# EAGLE design v1 (EAGLE 9.0.1)
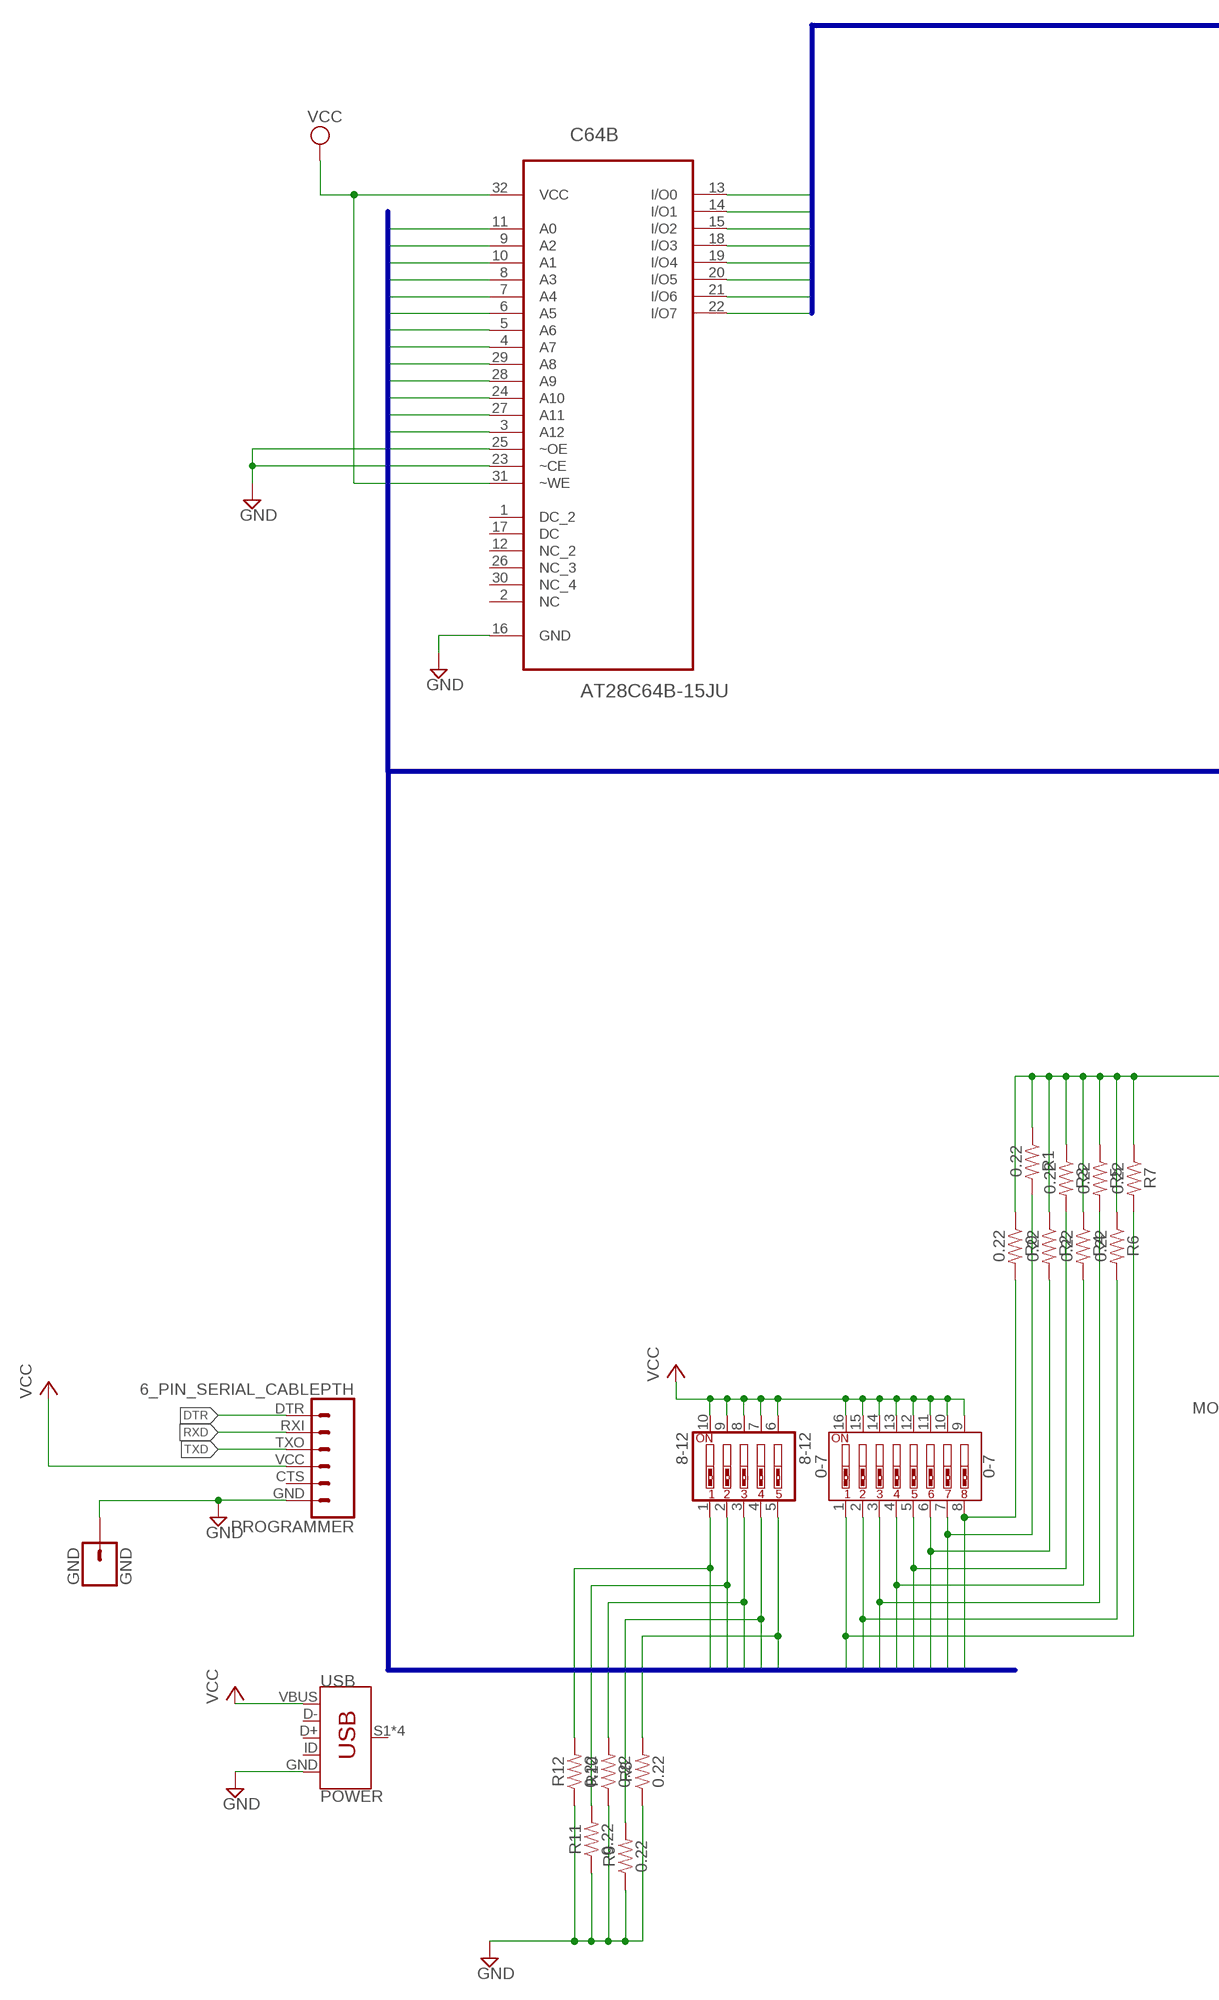
[diagram p0: schematic, sheet 1, part 1 of 2]
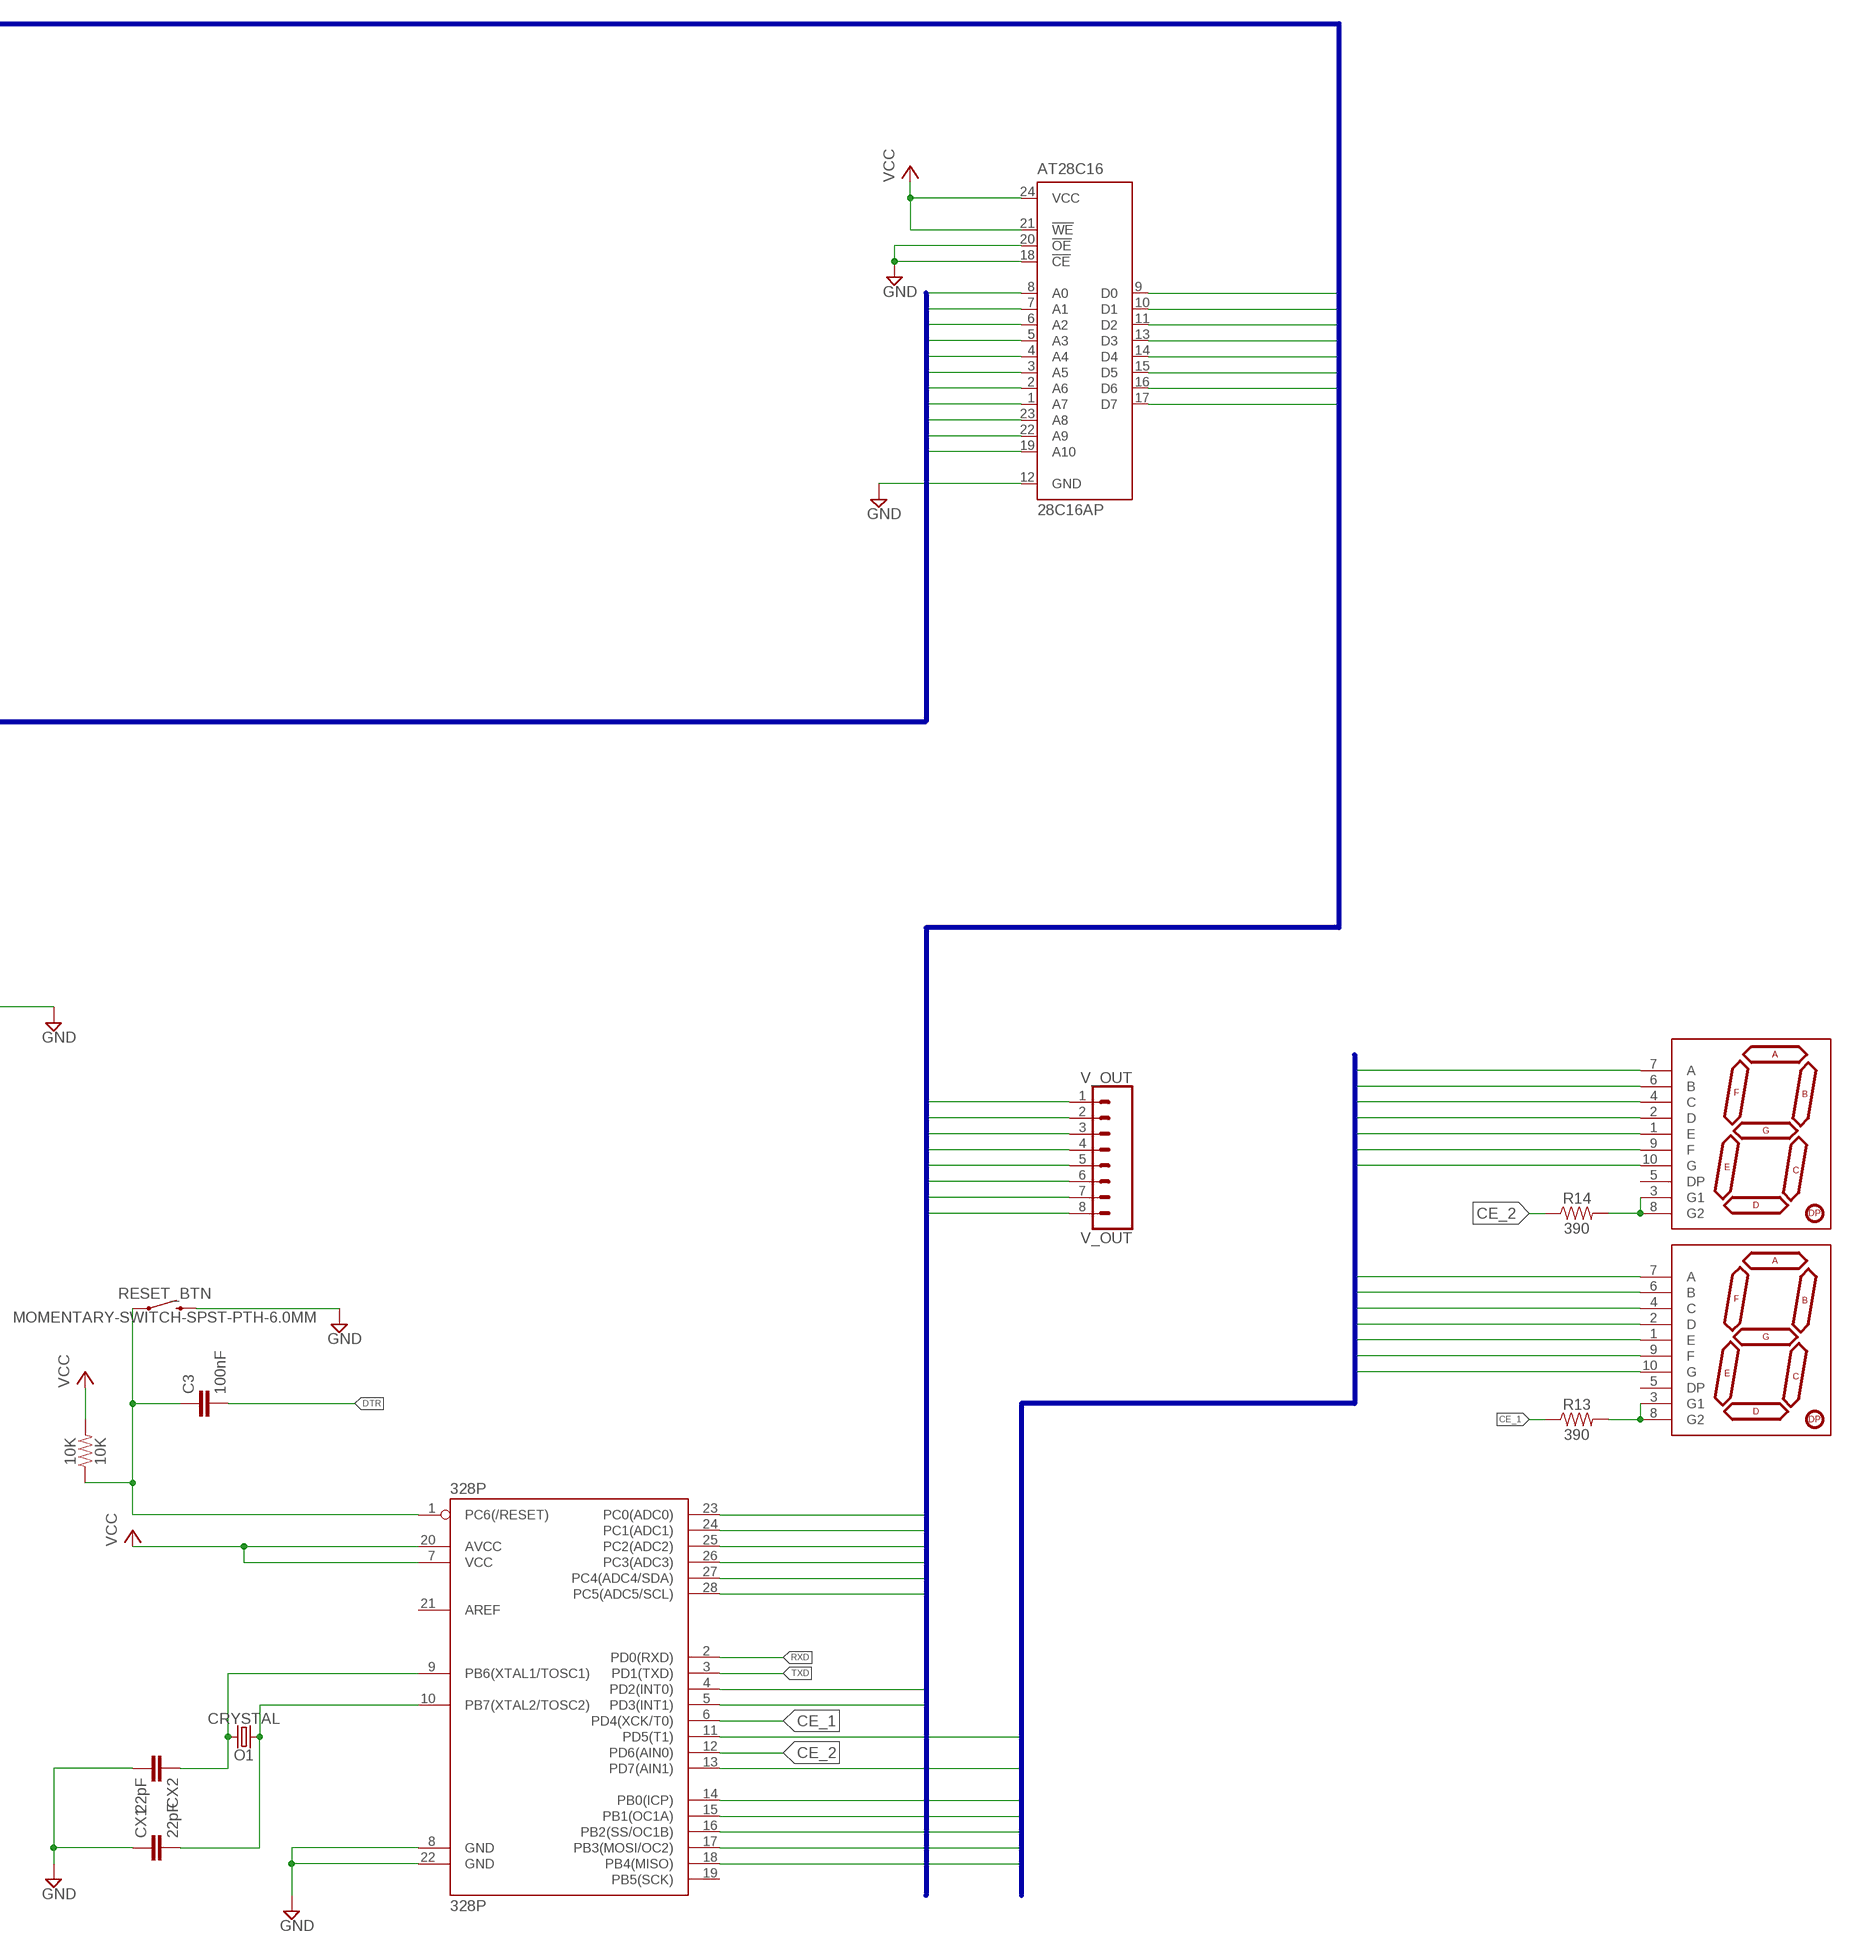
[diagram p1: schematic, sheet 1, part 2 of 2]

## Parts
0-7  0-7  DIP-08-PTH  [DIPSWITCH-08]
8-12  8-12  SW_DIP-5  [EDG-05]
10K  10K  100KOHM-0603-1/10W-1%  [0603]
328P  328P  ATMEGA328P_PDIP  [DIP28]
AT28C16  28C16AP  [DIL24-6]
C3  100nF  4.7PF-0603-50V-5%  [0603]
C64B  AT28C64B-15JU  [PLCC127P1500X1250X355-32N]
CRYSTAL  O1  CRYSTAL-16MHZPTH-HC49US  [HC49US]
CX1  22pF  1.0NF/1000PF-0603-50V-10%  [0603]
CX2  22pF  1.0NF/1000PF-0603-50V-10%  [0603]
GND  GND  CONN_01  [1X01]
N0  N1  7-SEGMENT-1DIGIT-1INCH-BLUE  [7-SEGMENT-1"PTH]
N1  N2  7-SEGMENT-1DIGIT-1INCH-BLUE  [7-SEGMENT-1"PTH]
PROGRAMMER  6_PIN_SERIAL_CABLEPTH  [FTDI_BASIC]
R0  0.22  0.22OHM-0805-1/4W-1%  [0805]
R1  0.22  0.22OHM-0805-1/4W-1%  [0805]
R2  0.22  0.22OHM-0805-1/4W-1%  [0805]
R3  0.22  0.22OHM-0805-1/4W-1%  [0805]
R4  0.22  0.22OHM-0805-1/4W-1%  [0805]
R5  0.22  0.22OHM-0805-1/4W-1%  [0805]
R6  0.22  0.22OHM-0805-1/4W-1%  [0805]
R7  0.22  0.22OHM-0805-1/4W-1%  [0805]
R8  0.22  0.22OHM-0805-1/4W-1%  [0805]
R9  0.22  0.22OHM-0805-1/4W-1%  [0805]
R10  0.22  0.22OHM-0805-1/4W-1%  [0805]
R11  0.22  0.22OHM-0805-1/4W-1%  [0805]
R12  0.22  0.22OHM-0805-1/4W-1%  [0805]
R13  390  390OHM-0603-1/10W-1%  [0603]
R14  390  390OHM-0603-1/10W-1%  [0603]
RESET_BTN  MOMENTARY-SWITCH-SPST-PTH-6.0MM  [TACTILE_SWITCH_PTH_6.0MM]
USB  POWER  USB_MINI-B_SMT  [USB-MINIB]
V_OUT  V_OUT  CONN_08"  [1X08]

## Nets
A0: 0-7.8 AT28C16.8(A0) C64B.11(A0) R0.2
A1: 0-7.7 AT28C16.7(A1) C64B.10(A1) R1.2
A2: 0-7.6 AT28C16.6(A2) C64B.9(A2) R2.2
A3: 0-7.5 AT28C16.5(A3) C64B.8(A3) R3.2
A4: 0-7.4 AT28C16.4(A4) C64B.7(A4) R4.2
A5: 0-7.3 AT28C16.3(A5) C64B.6(A5) R5.2
A6: 0-7.2 AT28C16.2(A6) C64B.5(A6) R6.2
A7: 0-7.1 AT28C16.1(A7) C64B.4(A7) R7.2
A8: 8-12.5 AT28C16.23(A8) C64B.29(A8) R8.2
A9: 8-12.4 AT28C16.22(A9) C64B.28(A9) R9.2
A10: 8-12.3 AT28C16.19(A10) C64B.24(A10) R10.2
A11: 8-12.2 C64B.27(A11) R11.2
A12: 8-12.1 C64B.3(A12) R12.2
CE_1: 328P.6(PD4(XCK/T0)) R13.1
CE_2: 328P.12(PD6(AIN0)) R14.1
D0: 328P.11(PD5(T1)) N0.4(C) N1.4(C)
D1: 328P.13(PD7(AIN1)) N0.2(D) N1.2(D)
D2: 328P.14(PB0(ICP)) N0.1(E) N1.1(E)
D3: 328P.15(PB1(OC1A)) N0.10(G) N1.10(G)
D4: 328P.16(PB2(SS/OC1B)) N0.9(F) N1.9(F)
D5: 328P.17(PB3(MOSI/OC2)) N0.7(A) N1.7(A)
D6: 328P.18(PB4(MISO)) N0.6(B) N1.6(B)
DTR: C3.2 PROGRAMMER.DTR
GND: 328P.8(GND) 328P.22(GND) AT28C16.12(GND) AT28C16.18(!CE) AT28C16.20(!OE) C64B.16(GND) C64B.23(~CE) C64B.25(~OE) CX1.1 CX2.2 GND.1 PROGRAMMER.GND R0.1 R1.1 R2.1 R3.1 R4.1 R5.1 R6.1 R7.1 R8.1 R9.1 R10.1 R11.1 R12.1 RESET_BTN.3 USB.GND
IO0: 328P.28(PC5(ADC5/SCL)) AT28C16.9(D0) C64B.13(I/O0) V_OUT.1
IO1: 328P.27(PC4(ADC4/SDA)) AT28C16.10(D1) C64B.14(I/O1) V_OUT.2
IO2: 328P.26(PC3(ADC3)) AT28C16.11(D2) C64B.15(I/O2) V_OUT.3
IO3: 328P.4(PD2(INT0)) AT28C16.13(D3) C64B.18(I/O3) V_OUT.4
IO4: 328P.25(PC2(ADC2)) AT28C16.14(D4) C64B.19(I/O4) V_OUT.5
IO5: 328P.5(PD3(INT1)) AT28C16.15(D5) C64B.20(I/O5) V_OUT.6
IO6: 328P.24(PC1(ADC1)) AT28C16.16(D6) C64B.21(I/O6) V_OUT.7
IO7: 328P.23(PC0(ADC0)) AT28C16.17(D7) C64B.22(I/O7) V_OUT.8
N$2: N0.3(G1) N0.8(G2) R13.2
N$3: N1.3(G1) N1.8(G2) R14.2
N$10: 10K.1 328P.1(PC6(/RESET)) C3.1 RESET_BTN.1
O1_1: 328P.10(PB7(XTAL2/TOSC2)) CRYSTAL.2 CX1.2
O1_2: 328P.9(PB6(XTAL1/TOSC1)) CRYSTAL.1 CX2.1
RXD: 328P.2(PD0(RXD)) PROGRAMMER.RXI
TXD: 328P.3(PD1(TXD)) PROGRAMMER.TXO
VCC: 0-7.9 0-7.10 0-7.11 0-7.12 0-7.13 0-7.14 0-7.15 0-7.16 8-12.6 8-12.7 8-12.8 8-12.9 8-12.10 10K.2 328P.7(VCC) 328P.20(AVCC) AT28C16.21(!WE) AT28C16.24(VCC) C64B.31(~WE) C64B.32(VCC) PROGRAMMER.VCC USB.VBUS
Unconnected: 328P.19(PB5(SCK)) 328P.21(AREF) C64B.1(DC_2) C64B.2(NC) C64B.12(NC_2) C64B.17(DC) C64B.26(NC_3) C64B.30(NC_4) N0.5(DP) N1.5(DP) PROGRAMMER.CTS USB.D+ USB.D- USB.ID USB.S1(SHIELD) USB.S2(SHIELD) USB.S3(SHIELD) USB.S4(SHIELD)

## Buses
A[0..12]
IO[0..7]
D[0..6]

## Library data of the parts
0-7 = SparkFun-Switches:DIP-08: 8-Position DIP Switch 8-circuit DIP (dual inline package) switch. Commonly used to physcially set a circuit's behavior. SparkFun Products DIP Switch - 8 Position <https://www.sparkfun.com/products/8034> (COM-08034); PROD_ID: SWCH-12197; SF_SKU: COM-08034
8-12 = special:SW_DIP-5: DIP SWITCH
10K = SparkFun-Resistors:100KOHM: 100kΩ resistor A resistor is a passive two-terminal electrical component that implements electrical resistance as a circuit element. Resistors act to reduce current flow, and, at the same time, act to lower voltage levels within circuits. - Wikipedia; PROD_ID: RES-07828; VALUE: 100k
328P = SparkFun-IC-Microcontroller:ATMEGA328P_PDIP: Atmel 328P Through hole ATMEGA328P uC used in the Arduino 32kb flash, 1k EEPROM, 2k SRAM Datasheet <http://www.sparkfun.com/datasheets/Components/SMD/ATMega328.pdf> SparkFun Products Storefront component: AVR 28 Pin 20MHz 32K 6A/D - ATMega328P <https://www.sparkfun.com/products/9061> (COM-09061) SparkFun Simon Says - Through-Hole Soldering Kit <https://www.sparkfun.com/products/10547> (KIT-10547) SparkFun Learn to Solder - Simon Says <https://www.sparkfun.com/products/13708> (KIT-13708) SparkFun BigTime Watch Kit <https://www.sparkfun.com/products/11734> (KIT-11734) SparkFun ClockIt <https://www.sparkfun.com/products/10930> (KIT-10930) SparkFun Serial Enabled LCD Kit <https://www.sparkfun.com/products/10097> (LCD-10097) SparkFun Simon Tilts - Through Hole Soldering Kit <https://www.sparkfun.com/products/12634> (KIT-12634) SparkFun Frequency Counter Kit <https://www.sparkfun.com/products/10140> (KIT-10140) FabFM Radio Kit <https://www.sparkfun.com/products/11043> (KIT-11043) SparkFun Binary Blaster Kit <https://www.sparkfun.com/products/12037> (KIT-12037) SparkFun Metro-Gnome <https://www.sparkfun.com/products/9236> (KIT-09236) ATmega328 with Arduino Optiboot (Uno) <https://www.sparkfun.com/products/10524> (DEV-10524); PROD_ID: IC-09136
AT28C16 = microchip:28*16A: CMOS EPROM 16 K (2 K x 8) Source: ww1.microchip.com/downloads/en/DeviceDoc/11125J.pdf
C3 = SparkFun-Capacitors:4.7PF: 4.7pF ceramic capacitors A capacitor is a passive two-terminal electrical component used to store electrical energy temporarily in an electric field.; PROD_ID: CAP-07880; VALUE: 4.7pF
C64B = Atmel_By_element14_Batch_1-00:AT28C64B-15JU: 64K Parallel EEPROM; DESCRIPTION: 64K Parallel EEPROM; MPN: AT28C64B-15JU; OC_FARNELL: 1095783; OC_NEWARK: 96K6556; PACKAGE: PLCC-32; SUPPLIER: Atmel
CRYSTAL = SparkFun-Clocks:CRYSTAL-16MHZ: 16MHz Crystal Digikey Example <http://www.digikey.com/product-search/en?keywords=535-9122-1-ND> Frequency: 16MHz Frequency Stability: ±50ppm Frequency Tolerance: ±20ppm Load Capacitance: 18pF SparkFun Products: Pro Micro -5V/16MHz <https://www.sparkfun.com/products/12640> SparkFun Serial Enabled LCD Kit <https://www.sparkfun.com/products/10097>; PROD_ID: XTAL-08181; SF_ID: COM-00536; VALUE: 16MHz
CX1 CX2 = SparkFun-Capacitors:1.0NF/1000PF: 1nF/1,000pF ceramic capacitors A capacitor is a passive two-terminal electrical component used to store electrical energy temporarily in an electric field.; PROD_ID: CAP-07886; VALUE: 1nF
GND = SparkFun-Connectors:CONN_01: Single connection point. Often used as Generic Header-pin footprint for 0.1 inch spaced/style header connections On any of the 0.1 inch spaced packages, you can populate with these: Break Away Headers - Straight <https://www.sparkfun.com/products/116> (PRT-00116) Break Away Male Headers - Right Angle <https://www.sparkfun.com/products/553> (PRT-00553) Female Headers <https://www.sparkfun.com/products/115> (PRT-00115) Break Away Headers - Machine Pin <https://www.sparkfun.com/products/117> (PRT-00117) Break Away Female Headers - Swiss Machine Pin <https://www.sparkfun.com/products/743> (PRT-00743) This device is also useful as a general connection point to wire up your design to another part of your project. Our various solder wires solder well into these plated through hole pads. Hook-Up Wire - Assortment (Stranded, 22 AWG) <https://www.sparkfun.com/products/11375> (PRT-11375) Hook-Up Wire - Assortment (Solid Core, 22 AWG) <https://www.sparkfun.com/products/11367> (PRT-11367) View the entire wire category on our website here <https://www.sparkfun.com/categories/141> Special notes: SMTSO-256-ET is a "flush mount" nut for a 4-40 screw. We mostly use this on specialty testbeds; it is a nice way to connect hardware to your PCB at an adjustable hieght. Also note, the SNAP packages are for using a snappable style connector. We sell a baggie of snaps and they are also used on two LilyPad designs: Snap Assortment - 30 pack (male and female) <https://www.sparkfun.com/products/11347> (DEV-11347) LilyPad Arduino SimpleSnap <https://www.sparkfun.com/products/10941> (DEV-10941) LilyPad SimpleSnap Protoboard <https://www.sparkfun.com/products/10940> (DEV-10940)
N0 N1 = SparkFun-LED:7-SEGMENT-1DIGIT-1INCH: 7-Segment Display, single digit, 1" EZ is for kits. Pads are only exposed on the bottom side to help prevent soldering in upside down. Datasheet (Red) <https://cdn.sparkfun.com/datasheets/Components/LED/YSD-160AR4B-8.pdf> Datasheet (Blue) <https://cdn.sparkfun.com/datasheets/Components/LED/YSD-160AB3C-8.pdf> SparkFun Products 7-Segment Display - LED (Red) <https://www.sparkfun.com/products/8546> (COM-08546) 7-Segment Display - LED (Blue) <https://www.sparkfun.com/products/9191> (COM-09191); PROD_ID: COMP-09495; VALUE: YSD-160AB3C-8
PROGRAMMER = SparkFun-Connectors:6_PIN_SERIAL_CABLE: 6-pin header connection for use with the "FTDI BASIC" pinout - CABLE SIDE. Also known as "Arduino Serial Program Header". This is used on a design to provide a 6-pin connection point for serial communication usually from a USB cable (D+/D-) to these headers (RX/TX). It also has the remaining pins necessary for programming in the Arduino evironment (DTR, GND, and sometimes VCC). Note, this device has "CABLE" in the name. It is intended to be used on a design that usually lives on the end of your USB cable and prvides the converter chip (FTDI232 or FTDI231x) to commnicate serial RX/TX. The "sister" device, named "TARGET" is inteneded to be used on a design that contains a target micro-controller that you wish to program. You can populate with some of these: Female Headers <https://www.sparkfun.com/products/115> (PRT-00115) For reference (or to suit your programming needs) check out these designs: SparkFun FTDI Basic Breakout - 5V <https://www.sparkfun.com/products/9716> (DEV-09716) SparkFun FTDI Basic Breakout - 3.3V <https://www.sparkfun.com/products/9873> (DEV-09873) SparkFun FTDI SmartBasic <https://www.sparkfun.com/products/12935> (DEV-12935) SparkFun Beefy 3 - FTDI Basic Breakout <https://www.sparkfun.com/products/13746> (DEV-13746)
R0 R1-R12 = SparkFun-Resistors:0.22OHM: 0.22Ω resistor A resistor is a passive two-terminal electrical component that implements electrical resistance as a circuit element. Resistors act to reduce current flow, and, at the same time, act to lower voltage levels within circuits. - Wikipedia; PROD_ID: RES-09883
R13 R14 = SparkFun-Resistors:390OHM: 390Ω resistor A resistor is a passive two-terminal electrical component that implements electrical resistance as a circuit element. Resistors act to reduce current flow, and, at the same time, act to lower voltage levels within circuits. - Wikipedia; PROD_ID: RES-07864
RESET_BTN = SparkFun-Switches:MOMENTARY-SWITCH-SPST: Momentary Switch (Pushbutton) - SPST Normally-open (NO) SPST momentary switches (buttons, pushbuttons). Variants PTH-12MM - 12mm square, through-hole Momentary Pushbutton Switch - 12mm Square <https://www.sparkfun.com/products/9190> (COM-09190) PTH-6.0MM, PTH-6.0MM-KIT - 6.0mm square, through-hole Mini Pushbutton Switch <https://www.sparkfun.com/products/97> (COM-00097) KIT package intended for soldering kit's - only one side of pads' copper is exposed. PTH-RIGHT-ANGLE-KIT - Right-angle, through-hole Right Angle Tactile Button <https://www.sparkfun.com/products/10791> - Used on SparkFun BigTime Watch Kit <https://www.sparkfun.com/products/11734> SMD-12MM - 12mm square, surface-mount Tactile Button - SMD (12mm) <https://www.sparkfun.com/products/12993> (COM-12993) Used on SparkFun PicoBoard <https://www.sparkfun.com/products/11888> SMD-4.5MM - 4.5mm Square Trackball Switch Used on SparkFun Blackberry Trackballer Breakout <https://www.sparkfun.com/products/13169> SMD-4.6MMX2.8MM - 4.60mm x 2.80mm, surface mount Used on SparkFun SAMD21 Mini Breakout <https://www.sparkfun.com/products/13664> SMD-5.2MM, SMD-5.2-REDUNDANT - 5.2mm square, surface-mount Mini Pushbutton Switch - SMD <https://www.sparkfun.com/products/8720> (COM-08720) Used on Arduino Pro Mini <https://www.sparkfun.com/products/11114> REDUNDANT package connects both switch circuits together SMD-6.0X3.5MM - 6.0 x 3.5mm, surface mount Momentary Reset Switch SMD <https://www.sparkfun.com/products/8229> (COM-08229) SMD-6.2MM-TALL - 6.2mm square, surface mount Tactile Button - SMD (6mm) <https://www.sparkfun.com/products/12992> Used on SparkFun Digital Sandbox <https://www.sparkfun.com/products/12651> SMD-RIGHT-ANGLE - Right-angle, surface mount Used on SparkFun Block for Intel® Edison - Arduino <https://www.sparkfun.com/products/13036>; PROD_ID: SWCH-08441; SF_SKU: COM-00097
USB = SparkFun-Connectors:USB_MINI-B: USB type Mini-B Connector Breaks out 5th pin, and includes shield pins if needed. SparkFun Products: SparkFun FTDI Basic Breakout <https://www.sparkfun.com/products/9716> SparkFun XBee Explorer USB <https://www.sparkfun.com/products/11812> SparkFun Redboard <https://www.sparkfun.com/products/12757>; PROD_ID: CONN-08193; SF_ID: PRT-00587
V_OUT = SparkFun-Connectors:CONN_08: Multi connection point. Often used as Generic Header-pin footprint for 0.1 inch spaced/style header connections On any of the 0.1 inch spaced packages, you can populate with these: Break Away Headers - Straight <https://www.sparkfun.com/products/116> (PRT-00116) Break Away Male Headers - Right Angle <https://www.sparkfun.com/products/553> (PRT-00553) Female Headers <https://www.sparkfun.com/products/115> (PRT-00115) Break Away Headers - Machine Pin <https://www.sparkfun.com/products/117> (PRT-00117) Break Away Female Headers - Swiss Machine Pin <https://www.sparkfun.com/products/743> (PRT-00743) Arduino Stackable Header - 8 Pin <https://www.sparkfun.com/products/9279> (PRT-09279) For SCREWTERMINALS and SPRING TERMINALS visit here: Screw Terimnals on SparkFun.com <https://www.sparkfun.com/search/results?term=Screw+Terminals> (5mm/3.5mm/2.54mm spacing) This device is also useful as a general connection point to wire up your design to another part of your project. Our various solder wires solder well into these plated through hole pads. Hook-Up Wire - Assortment (Stranded, 22 AWG) <https://www.sparkfun.com/products/11375> (PRT-11375) Hook-Up Wire - Assortment (Solid Core, 22 AWG) <https://www.sparkfun.com/products/11367> (PRT-11367) View the entire wire category on our website here <https://www.sparkfun.com/categories/141> Special notes: Molex polarized connector foot print use with SKU : PRT-08231 with associated crimp pins and housings. 1MM SMD Version SKU: PRT-10208 NOTES ON THE VARIANTS LOCK and LOCK_LONGPADS... This footprint was designed to help hold the alignment of a through-hole component (i.e. 6-pin header) while soldering it into place. You may notice that each hole has been shifted either up or down by 0.005 of an inch from it's more standard position (which is a perfectly straight line). This slight alteration caused the pins (the squares in the middle) to touch the edges of the holes. Because they are alternating, it causes a "brace" to hold the component in place. 0.005 has proven to be the perfect amount of "off-center" position when using our standard breakaway headers. Although looks a little odd when you look at the bare footprint, once you have a header in there, the alteration is very hard to notice. Also,if you push a header all the way into place, it is covered up entirely on the bottom side.; PROD_ID: CONN-08438

## Board
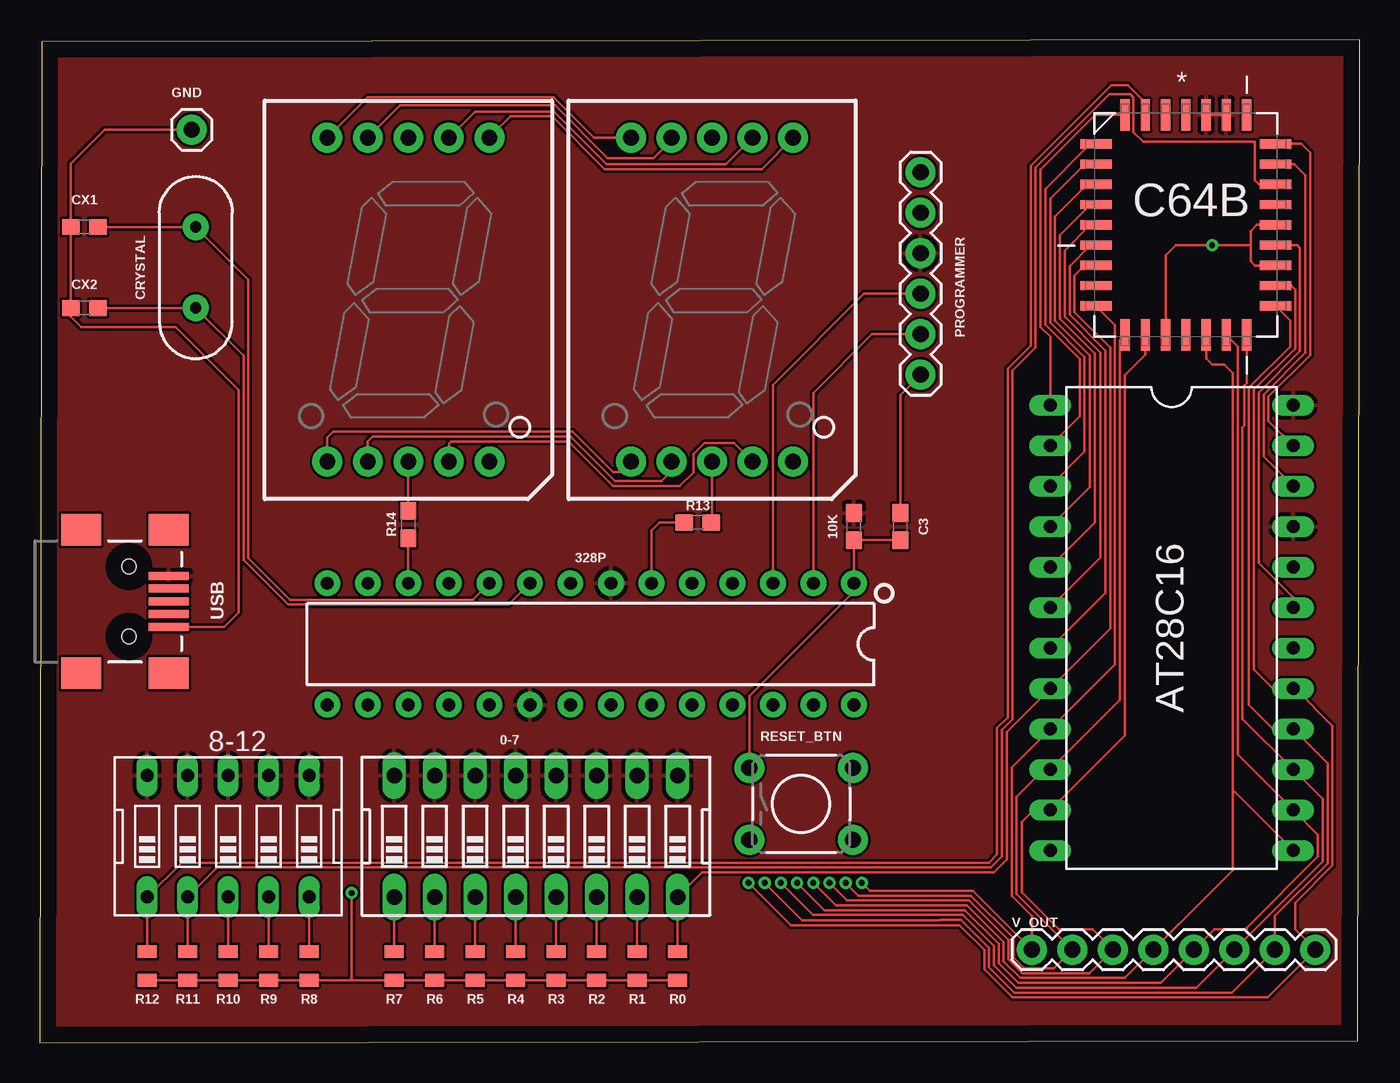
[diagram p2: board, top side]
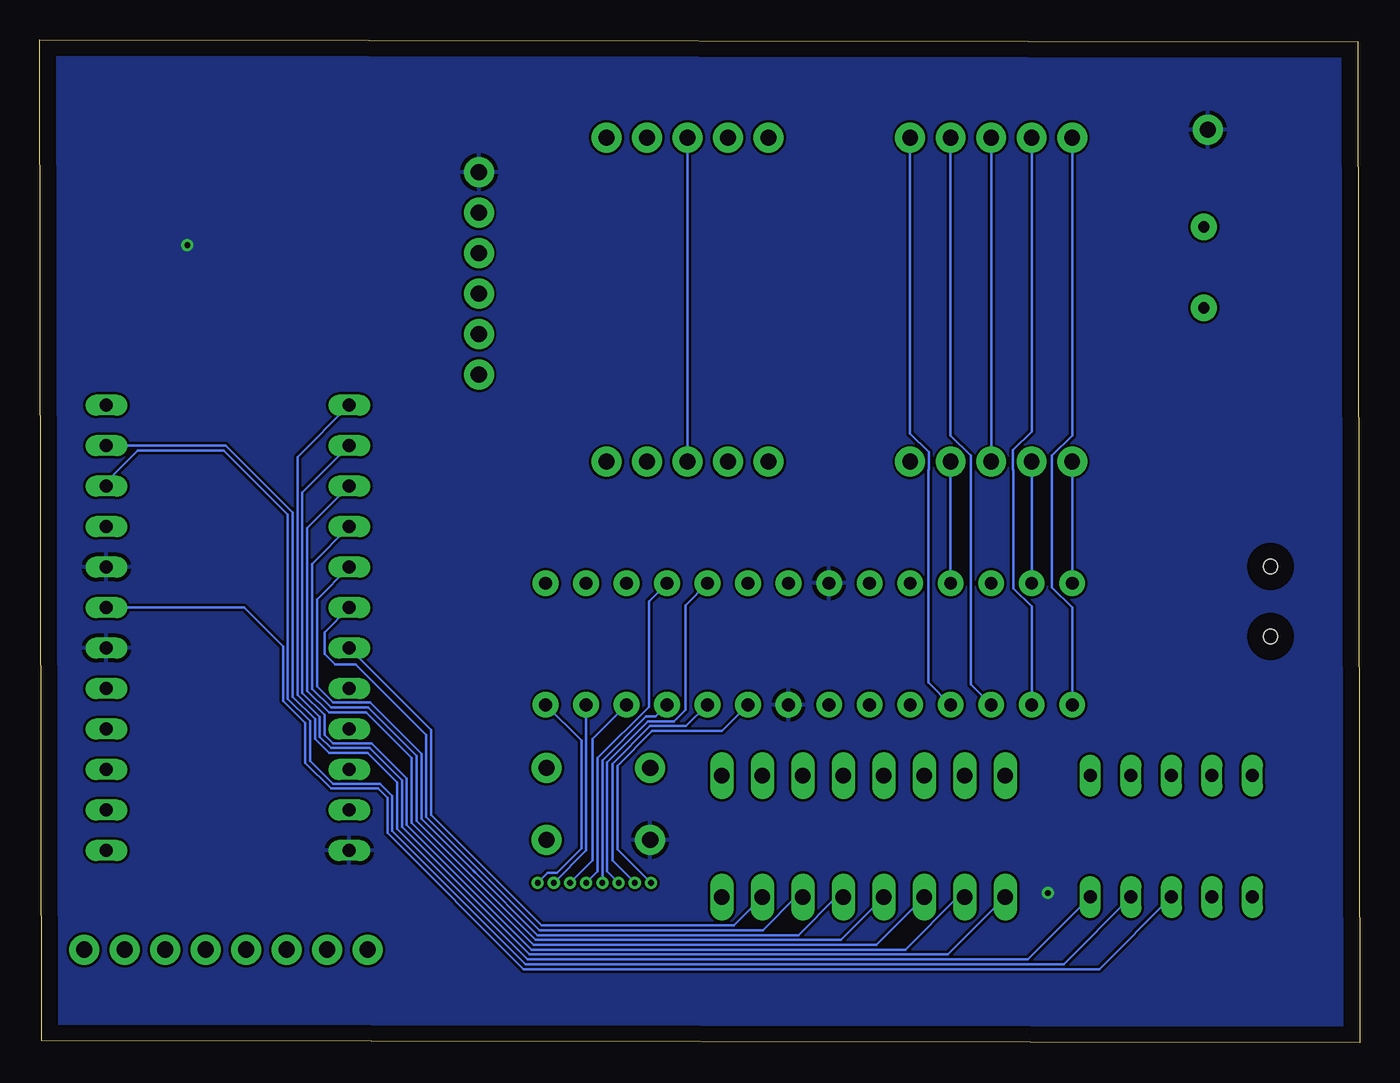
[diagram p3: board, bottom side, seen from below]

Size 82.78 x 62.92 mm. Coordinates in mm from the lower left corner, seen from the top.
Outline: 0,0 82.66,0.13 82.78,62.92 0.13,62.79 0,0
Copper layers (1*16): Top 0.035mm / dielectric 1.5mm / Bottom 0.035mm
Design rules "default": minimum track width 6mil, minimum drill 0.35mm, track to track 6mil, track to pad 6mil, pad to pad 6mil, via to via 6mil, smd to smd 6mil, copper to edge 40mil, drill to drill 6mil, minimum pad ring 10mil, minimum via ring 8mil, stop-mask expansion 4mil, vias tented up to drill 0mil, thermal gap 10mil

### Footprints (pad centres in the part's own frame; a part is rotated, then mirrored left to right if it is on the bottom)
DIPSWITCH-08 = drill 0.97 long: 1 -8.89,-3.81; 2 -6.35,-3.81; 3 -3.81,-3.81; 4 -1.27,-3.81; 5 1.27,-3.81; 6 3.81,-3.81; 7 6.35,-3.81; 8 8.89,-3.81; 9 8.89,3.81; 10 6.35,3.81; 11 3.81,3.81; 12 1.27,3.81; 13 -1.27,3.81; 14 -3.81,3.81; 15 -6.35,3.81; 16 -8.89,3.81
EDG-05 = drill 0.813 long: 1 -5.08,-3.81; 2 -2.54,-3.81; 3 0,-3.81; 4 2.54,-3.81; 5 5.08,-3.81; 6 5.08,3.81; 7 2.54,3.81; 8 0,3.81; 9 -2.54,3.81; 10 -5.08,3.81
0603 = smd 1.1 x 1: 1 -0.85,0; 2 0.85,0
DIP28 = drill 0.813 pad 1.626: 1 -16.51,-3.81; 2 -13.97,-3.81; 3 -11.43,-3.81; 4 -8.89,-3.81; 5 -6.35,-3.81; 6 -3.81,-3.81; 7 -1.27,-3.81; 8 1.27,-3.81; 9 3.81,-3.81; 10 6.35,-3.81; 11 8.89,-3.81; 12 11.43,-3.81; 13 13.97,-3.81; 14 16.51,-3.81; 15 16.51,3.81; 16 13.97,3.81; 17 11.43,3.81; 18 8.89,3.81; 19 6.35,3.81; 20 3.81,3.81; 21 1.27,3.81; 22 -1.27,3.81; 23 -3.81,3.81; 24 -6.35,3.81; 25 -8.89,3.81; 26 -11.43,3.81; 27 -13.97,3.81; 28 -16.51,3.81
DIL24-6 = drill 0.813 long: 1 -13.97,-7.62; 2 -11.43,-7.62; 3 -8.89,-7.62; 4 -6.35,-7.62; 5 -3.81,-7.62; 6 -1.27,-7.62; 7 1.27,-7.62; 8 3.81,-7.62; 9 6.35,-7.62; 10 8.89,-7.62; 11 11.43,-7.62; 12 13.97,-7.62; 13 13.97,7.62; 14 11.43,7.62; 15 8.89,7.62; 16 6.35,7.62; 17 3.81,7.62; 18 1.27,7.62; 19 -1.27,7.62; 20 -3.81,7.62; 21 -6.35,7.62; 22 -8.89,7.62; 23 -11.43,7.62; 24 -13.97,7.62
PLCC127P1500X1250X355-32N = smd 0.584 x 1.981: 1 0,6.909; 2 -1.27,6.909; 3 -2.54,6.909; 4 -3.81,6.909; 14 -3.81,-6.909; 15 -2.54,-6.909; 16 -1.27,-6.909; 17 0,-6.909; 18 1.27,-6.909; 19 2.54,-6.909; 20 3.81,-6.909; 30 3.81,6.909; 31 2.54,6.909; 32 1.27,6.909 | smd 1.981 x 0.584: 5 -5.639,5.08; 6 -5.639,3.81; 7 -5.639,2.54; 8 -5.639,1.27; 9 -5.639,0; 10 -5.639,-1.27; 11 -5.639,-2.54; 12 -5.639,-3.81; 13 -5.639,-5.08; 21 5.639,-5.08; 22 5.639,-3.81; 23 5.639,-2.54; 24 5.639,-1.27; 25 5.639,0; 26 5.639,1.27; 27 5.639,2.54; 28 5.639,3.81; 29 5.639,5.08
HC49US = drill 0.7 pad 1.651: 1 -2.54,0; 2 2.54,0
1X01 = drill 1.016 pad 1.88: 1 0,0
7-SEGMENT-1"PTH = drill 1 pad 1.88: 1 -5.08,-10.16; 2 -2.54,-10.16; 3 0,-10.16; 4 2.54,-10.16; 5 5.08,-10.16; 6 5.08,10.16; 7 2.54,10.16; 8 0,10.16; 9 -2.54,10.16; 10 -5.08,10.16
FTDI_BASIC = drill 1.016 pad 1.88: CTS 10.16,0; DTR 0,0; GND 12.7,0; RXI 2.54,0; TXO 5.08,0; VCC 7.62,0
0805 = smd 0.8 x 1.2: 1 -0.9,0; 2 0.9,0
TACTILE_SWITCH_PTH_6.0MM = drill 1.016 pad 1.88: 1 -3.251,2.261; 2 3.251,2.261; 3 -3.251,-2.261; 4 3.251,-2.261
USB-MINIB = smd 2.5 x 0.5: D+ 2.5,0; D- 2.5,0.8; GND 2.5,-1.6; ID 2.5,-0.8; VBUS 2.5,1.6 | smd 2.5 x 2: S1 -3,4.5; S2 2.5,4.5; S3 -3,-4.5; S4 2.5,-4.5 | hole 0.9: 0,2.2; 0,-2.2
1X08 = drill 1.016 pad 1.88: 1 0,0; 2 2.54,0; 3 5.08,0; 4 7.62,0; 5 10.16,0; 6 12.7,0; 7 15.24,0; 8 17.78,0

### Placement (x,y rotation side)
0-7  31.11,12.95 0 top
8-12  11.81,12.95 0 top
10K  51.05,32.39 90 top
328P  34.54,25.02 180 top
AT28C16  70.99,26.04 270 top
C3  53.97,32.39 90 top
C64B  71.88,51.31 0 top
CRYSTAL  9.78,48.64 90 top
CX1  2.79,51.18 0 top
CX2  2.79,46.1 180 top
GND  9.52,57.28 0 top
N0  42.16,46.61 0 top
N1  23.11,46.61 0 top
PROGRAMMER  55.25,41.91 90 top
R0  40,4.83 90 top
R1  37.47,4.83 90 top
R2  34.92,4.83 90 top
R3  32.39,4.83 90 top
R4  29.84,4.83 90 top
R5  27.31,4.83 90 top
R6  24.77,4.83 90 top
R7  22.23,4.83 90 top
R8  16.89,4.83 90 top
R9  14.35,4.83 90 top
R10  11.81,4.83 90 top
R11  9.27,4.83 90 top
R12  6.73,4.83 90 top
R13  41.28,32.64 0 top
R14  23.11,32.51 90 top
RESET_BTN  47.75,14.99 0 top
USB  5.59,27.69 0 top
V_OUT  62.23,5.84 0 top

### Tracks (layer width: path | path; a pad name or v marks a point on that pad's centre or on a via)
A0
  Top 0.152: R0.2 0-7.8 40,9.17 41.53,10.69 59.84,10.69 60.66,11.51 60.66,19.51 AT28C16.8 67.13,25.98 67.13,43.61 64.9,45.85 64.9,48.13 65.53,48.77 C64B.11
A1
  Top 0.152: 0-7.7 R1.2 | AT28C16.7 66.83,28.22 66.83,43.43 64.59,45.67 64.59,48.72 65.91,50.04 C64B.10
  Bottom 0.152: 0-7.7 39.24,7.37 51.31,7.37 58.24,14.3 58.24,19.63 AT28C16.7
A2
  Top 0.152: 0-7.6 R2.2 | AT28C16.6 66.52,30.46 66.52,43.31 64.29,45.54 64.29,49.69 65.91,51.31 C64B.9
  Bottom 0.152: 0-7.6 35.36,9.14 37.44,7.06 51.43,7.06 58.55,14.17 58.55,19.32 62.98,23.75 64.28,23.75 64.92,24.4 64.92,25.76 AT28C16.6
A3
  Top 0.152: 0-7.5 R3.2 | AT28C16.5 66.17,32.64 66.17,43.23 63.98,45.42 63.98,50.65 65.91,52.58 C64B.8
  Bottom 0.152: AT28C16.5 65.41,27.81 65.41,22.34 64.4,21.34 62.05,21.34 58.85,18.14 58.85,14.05 55.61,10.81 55.55,10.75 55.49,10.68 51.56,6.76 35.2,6.76 32.82,9.14 0-7.5
A4
  Top 0.152: R4.2 0-7.4 | AT28C16.4 65.86,34.87 65.86,43.11 63.68,45.29 63.68,51.82 65.71,53.85 C64B.7
  Bottom 0.152: 0-7.4 32.54,6.45 51.69,6.45 59.16,13.92 59.16,18.01 62.18,21.03 64.53,21.03 65.71,22.21 65.71,30.05 AT28C16.4
A5
  Top 0.152: 0-7.3 R5.2 | AT28C16.3 65.53,37.08 65.53,43 63.37,45.16 63.37,52.96 65.66,55.25 65.79,55.12 C64B.6
  Bottom 0.152: 0-7.3 30.3,6.15 51.81,6.15 59.46,13.79 59.46,17.88 62.31,20.73 64.65,20.73 66.02,22.09 66.02,32.28 AT28C16.3
A6
  Top 0.152: R6.2 0-7.2 | AT28C16.2 65.23,39.32 65.23,42.88 63.07,45.04 63.07,53.55 65.59,56.07 65.68,56.16 65.91,56.39 C64B.5
  Bottom 0.152: 0-7.2 25.2,9.14 28.5,5.84 51.94,5.84 59.77,13.67 59.77,16.59 61.98,18.8 64.4,18.8 64.92,19.32 64.92,20.56 66.32,21.96 66.32,34.52 AT28C16.2
A7
  Top 0.152: R7.2 0-7.1 | AT28C16.1 63.37,44.3 62.76,44.91 62.76,54.76 66.22,58.22 C64B.4
  Bottom 0.152: AT28C16.1 66.62,36.75 66.62,21.83 65.23,20.44 65.23,19.19 64.53,18.49 62.1,18.49 60.07,16.46 60.07,13.54 52.07,5.54 25.83,5.54 0-7.1
A8
  Top 0.152: R8.2 8-12.5 | AT28C16.23 77.06,39.01 77.06,40.54 79.68,43.16 79.68,55.83 79.12,56.39 C64B.29
  Bottom 0.152: 8-12.5 20.8,5.23 52.19,5.23 60.38,13.41 60.38,16.33 62.23,18.19 64.65,18.19 65.53,19.06 65.53,20.31 66.93,21.71 66.93,33.27 71.12,37.47 AT28C16.23
A9
  Top 0.152: R9.2 8-12.4 | C64B.28 78.7,55.12 79.38,54.44 79.38,43.28 76.76,40.67 76.76,36.78 AT28C16.22
  Bottom 0.152: AT28C16.22 78.61,35.18 76.63,37.16 71.25,37.16 67.23,33.15 67.23,21.58 65.84,20.18 65.84,17.69 64.4,16.26 61.44,16.26 60.68,15.49 60.68,13.29 52.32,4.93 18.57,4.93 8-12.4
A10
  Top 0.152: R10.2 8-12.3 | C64B.24 78.87,50.04 79.05,49.86 79.05,43.38 76.45,40.79 76.45,30.09 78.61,27.93 AT28C16.19
  Bottom 0.152: 8-12.3 16.33,4.62 52.45,4.62 60.98,13.16 60.98,15.37 61.57,15.95 64.53,15.95 66.14,17.57 66.14,20.06 67.54,21.46 67.54,24.87 69.98,27.31 AT28C16.19
A11
  Top 0.152: R11.2 8-12.2 11.12,11 59.67,11 60.35,11.68 60.35,19.63 61.01,20.29 61.01,42.16 62.46,43.61 62.46,54.89 67.07,59.5 68.39,59.5 68.59,59.3 68.59,57.14 69.22,56.52 76.2,56.52 76.2,54.1 76.45,53.85 C64B.27
A12
  Top 0.152: R12.2 8-12.1 8.89,11.3 59.54,11.3 60.05,11.81 60.05,19.76 60.71,20.42 60.71,42.29 62.15,43.74 62.15,55.02 67.21,60.07 68.25,60.07 69.34,58.98 C64B.3
CE_1
  Top 0.152: 328P.6 38.35,32.13 38.86,32.64 R13.1
CE_2
  Top 0.152: R14.1 328P.12
D0
  Top 0.152: N0.4 43.54,37.62 41.68,37.62 41,36.93 41,35.79 40.13,34.92 35.97,34.92 33.17,37.72 25.78,37.72 25.65,37.59 N1.4
  Bottom 0.152: N1.4 328P.11
D1
  Top 0.152: N0.2 39.62,35.86 38.99,35.23 36.09,35.23 33.3,38.02 20.88,38.02 20.57,37.72 N1.2
  Bottom 0.152: N1.2 328P.13
D2
  Top 0.152: N0.1 36.45,35.81 35.94,35.81 35.31,36.45 33.43,38.33 18.39,38.33 18.03,37.97 N1.1
  Bottom 0.152: N1.1 328P.14
D3
  Top 0.152: N1.10 20.57,59.31 32.23,59.31 34.77,56.77 N0.10
  Bottom 0.152: N1.10 18.03,38.1 19.3,36.83 19.3,28.57 18.03,27.31 328P.15
D4
  Top 0.152: N1.9 22.61,58.8 32.31,58.8 35.61,55.5 38.48,55.5 39.62,56.64 N0.9
  Bottom 0.152: N1.9 20.57,38.35 21.74,37.19 21.74,35.97 21.72,35.94 21.72,28.5 20.57,27.36 328P.16
D5
  Top 0.152: N1.7 27.31,58.42 32.26,58.42 35.56,55.12 43.05,55.12 N0.7
  Bottom 0.152: N1.7 25.65,38.1 24.38,36.83 24.38,22.48 328P.17
D6
  Top 0.152: N0.6 45.29,54.81 35.43,54.81 32.13,58.11 29.54,58.11 N1.6
  Bottom 0.152: N1.6 28.19,38.23 27.03,37.06 27.03,35.97 27.05,35.94 27.05,22.61 328P.18
DTR
  Top 0.152: PROGRAMMER.DTR 53.97,40.64 C3.2
GND  (via drill 0.35)
  Top 0.152: 19.56,3.93 R7.1 R6.1 R5.1 R4.1 R3.1 R2.1 R1.1 R0.1 | 19.56,3.93 R8.1 R9.1 R10.1 R11.1 R12.1 | C64B.23 76.2,48.77 75.95,49.02 75.95,50.04 | 75.95,50.04 75.95,50.93 76.33,51.31 C64B.25 | USB.GND 11.56,26.09 12.47,27 12.47,40.93 8.51,44.89 2.6,44.89 1.94,45.55 CX2.2 CX1.1 1.94,55.16 4.06,57.28 GND.1 | 75.95,50.04 v73.53,50.04 71.25,50.04 70.61,49.4 C64B.16 | 19.56,3.93 v19.56,9.4
  pour Bottom: 82.17,0.25 0.25,0.25 0.25,63.12 82.8,63.12 82.8,0.25
IO0  (via drill 0.35)
  Top 0.152: C64B.13 67.44,45.03 67.44,23.75 AT28C16.9 60.96,17.27 60.96,9.22 62.23,7.95 V_OUT.1 58.53,9.54 52.06,9.54 v51.56,10.03
  Bottom 0.152: v51.56,10.03 50.93,10.67 50.34,10.67 48.82,12.19 48.82,18.97 328P.28
IO1  (via drill 0.35)
  Top 0.152: C64B.14 67.74,44.07 67.74,21.51 AT28C16.10 62.99,17.14 61.27,15.42 61.27,9.35 V_OUT.2 63.6,4.67 61.75,4.67 61.06,5.36 61.06,6.58 58.41,9.23 51.35,9.23 v50.55,10.03
  Bottom 0.152: v50.55,10.03 48.51,12.07 328P.27
IO2  (via drill 0.35)
  Top 0.152: C64B.15 69.34,43.18 68.05,41.89 68.05,19.28 AT28C16.11 62.36,14.61 61.59,13.84 61.59,9.45 63.93,7.11 66.04,7.11 V_OUT.3 65.84,4.37 61.62,4.37 60.76,5.23 60.76,6.45 58.28,8.93 50.64,8.93 v49.53,10.03
  Bottom 0.152: v49.53,10.03 48.11,11.46 48.11,19.07 328P.26
IO3  (via drill 0.35)
  Top 0.152: V_OUT.4 71.42,7.42 | C64B.18 73.15,42.93 73.53,42.55 74.3,42.55 74.83,42.01 74.83,15.85 | AT28C16.13 74.83,15.85 | V_OUT.4 74.83,10.82 74.83,15.85 | v48.51,10.03 49.92,8.62 58.16,8.62 60.45,6.33 60.45,5.11 61.49,4.06 68.07,4.06 V_OUT.4
  Bottom 0.152: 328P.4 44.58,27.69 44.58,21.08 47.8,17.86 47.8,10.74 v48.51,10.03
IO4  (via drill 0.35)
  Top 0.152: C64B.19 75.13,43.69 75.13,18.09 AT28C16.14 80.16,13.06 80.16,11.68 75.69,7.21 75.69,7.11 73.66,7.11 V_OUT.5 70.31,3.76 61.37,3.76 60.15,4.98 60.15,6.2 58.03,8.32 49.21,8.32 v47.5,10.03
  Bottom 0.152: v47.5,10.03 47.5,17.73 44.76,20.47 44.17,20.47 328P.25
IO5  (via drill 0.35)
  Top 0.152: C64B.20 75.69,41.38 75.54,41.22 75.54,38.71 75.44,38.61 75.44,20.32 AT28C16.15 80.47,15.29 80.47,11.38 V_OUT.6 72.54,3.45 61.24,3.45 59.84,4.85 59.84,6.07 57.9,8.01 48.5,8.01 v46.48,10.03
  Bottom 0.152: v46.48,10.03 47.19,10.74 47.19,17.6 44.63,20.17 43,20.17 42.29,20.88 42.29,27.43 328P.5
IO6  (via drill 0.35)
  Top 0.152: C64B.21 78.44,45.31 78.44,43.69 75.84,41.1 75.84,21.18 77.34,19.68 AT28C16.16 80.77,17.53 80.77,11.25 77.47,7.95 V_OUT.7 74.78,3.15 61.11,3.15 59.54,4.73 59.54,5.95 57.78,7.71 56.48,7.71 56.45,7.68 47.81,7.68 v45.47,10.03
  Bottom 0.152: v45.47,10.03 46.86,11.43 46.86,17.5 44.5,19.86 42.24,19.86 328P.24
IO7  (via drill 0.35)
  Top 0.152: C64B.22 78.49,47.5 78.74,47.24 78.74,43.56 76.15,40.97 76.15,23.42 77.34,22.23 AT28C16.17 78.74,22.23 81.08,19.89 81.08,11.13 78.74,8.79 78.74,7.11 V_OUT.8 77.01,2.85 60.99,2.85 59.23,4.6 59.23,5.82 57.68,7.38 47.1,7.38 v44.45,10.03
  Bottom 0.152: v44.45,10.03 46.56,12.14 46.56,17.38 44.38,19.56 40,19.56 328P.23
N$2
  Top 0.152: N0.3 42.16,32.68 R13.2
  Bottom 0.152: N0.8 N0.3
N$3
  Top 0.152: R14.2 N1.3
  Bottom 0.152: N1.8 N1.3
N$10
  Top 0.152: RESET_BTN.1 44.5,21.77 51.18,28.45 51.18,28.7 328P.1 10K.1 C3.1
O1_1
  Top 0.152: CX1.2 CRYSTAL.2 13.08,47.88 13.08,30.4 15.7,27.79 27.15,27.79 328P.10
O1_2
  Top 0.152: CX2.1 CRYSTAL.1 12.78,43.1 12.78,30.28 15.57,27.48 29.39,27.48 328P.9
RXD
  Top 0.152: PROGRAMMER.RXI 52.2,44.45 48.51,40.77 328P.2
TXD
  Top 0.152: 328P.3 45.97,41.27 51.69,46.99 PROGRAMMER.TXO
VCC
  Top 0.152: C64B.31 C64B.32
  pour Top: 0.25,62.48 82.8,62.48 82.8,0.25 0.25,0.25

### Text on the board
tValues: P_2 | P_1